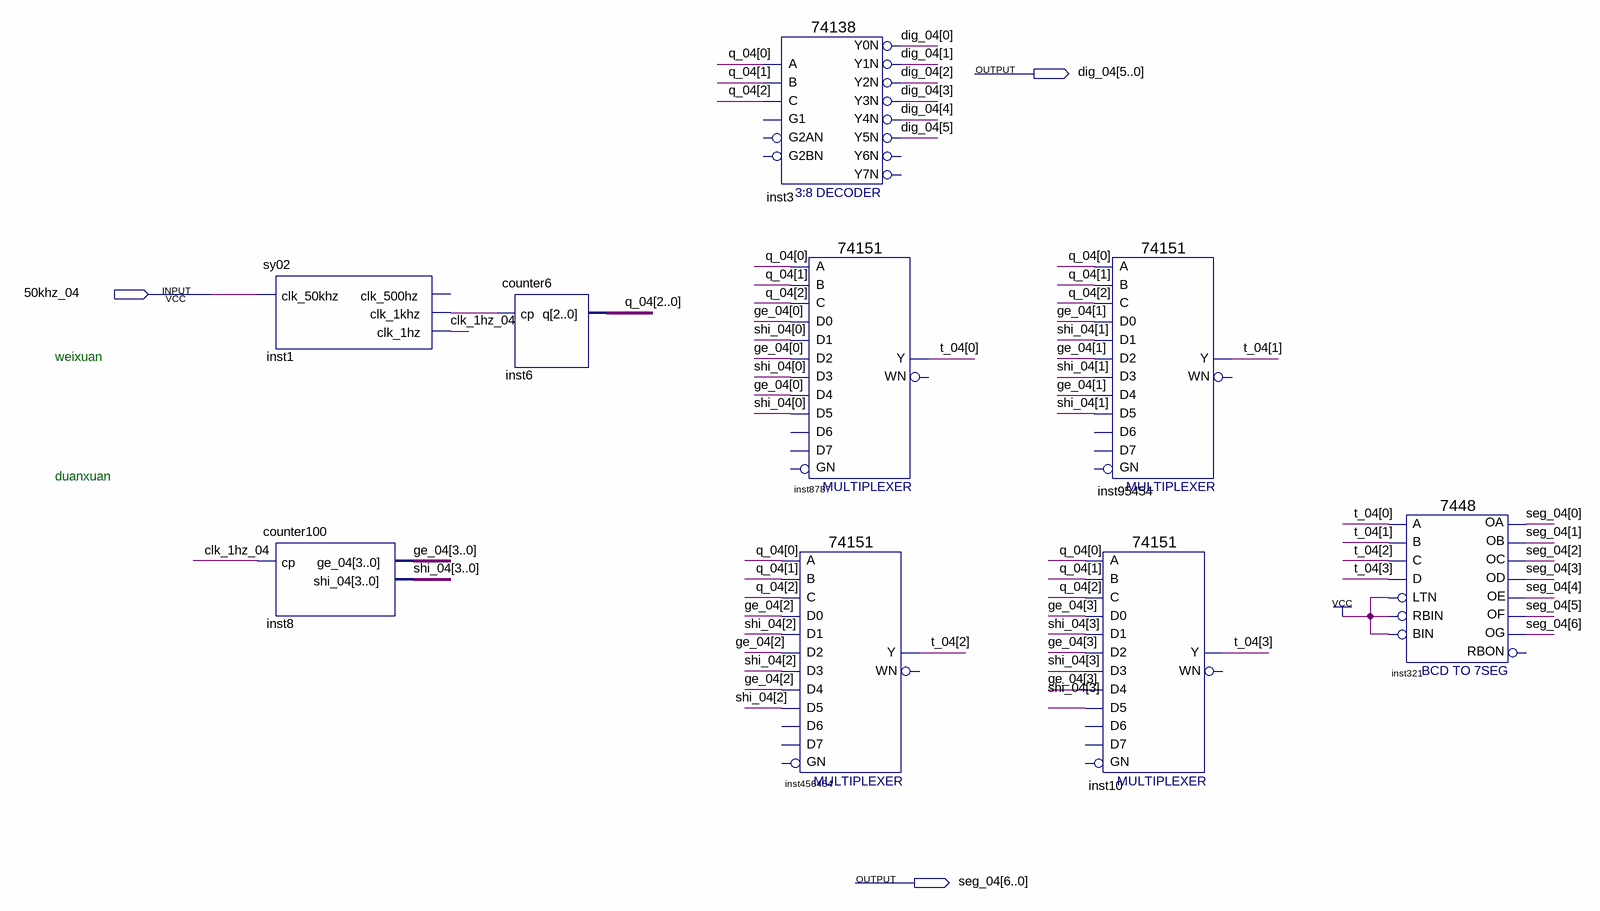
[diagram p0: schematic sheet]
// Quartus schematic sy03_m100_04_2.bdf as structural Verilog: 9 symbols, 3 pins
module sy03_m100_04_2 (
  input  \50khz_04 ,
  output [5:0] dig_04,
  output [6:0] seg_04
);

  wire clk_1hz_04, inst1_clk_1khz;
  wire [2:0] q_04;
  wire [3:0] ge_04, shi_04, t_04;

  sy02 inst1 (.clk_50khz(\50khz_04 ), .clk_1khz(inst1_clk_1khz), .clk_1hz(clk_1hz_04));  // open: clk_500hz
  counter100 inst8 (.cp(clk_1hz_04), .ge_04(ge_04), .shi_04(shi_04));
  counter6 inst6 (.cp(inst1_clk_1khz), .q(q_04));
  \74138  inst3 (
    .A(q_04[0]), .B(q_04[1]), .C(q_04[2]), .Y0N(dig_04[0]), .Y1N(dig_04[1]), .Y2N(dig_04[2]),
    .Y3N(dig_04[3]), .Y4N(dig_04[4]), .Y5N(dig_04[5]));  // open: G1, G2AN, G2BN, Y6N, Y7N
  \74151  inst8787 (
    .C(q_04[2]), .B(q_04[1]), .A(q_04[0]), .D5(shi_04[0]), .D0(ge_04[0]), .D1(shi_04[0]), .D4(ge_04[0]),
    .D3(shi_04[0]), .D2(ge_04[0]), .Y(t_04[0]));  // open: GN, D6, D7, WN
  \74151  inst456454 (
    .C(q_04[2]), .B(q_04[1]), .A(q_04[0]), .D5(shi_04[2]), .D0(ge_04[2]), .D1(shi_04[2]), .D4(ge_04[2]),
    .D3(shi_04[2]), .D2(ge_04[2]), .Y(t_04[2]));  // open: GN, D6, D7, WN
  \74151  inst95454 (
    .C(q_04[2]), .B(q_04[1]), .A(q_04[0]), .D5(shi_04[1]), .D0(ge_04[1]), .D1(shi_04[1]), .D4(ge_04[1]),
    .D3(shi_04[1]), .D2(ge_04[1]), .Y(t_04[1]));  // open: GN, D6, D7, WN
  \74151  inst10 (
    .C(q_04[2]), .B(q_04[1]), .A(q_04[0]), .D5(shi_04[3]), .D0(ge_04[3]), .D1(shi_04[3]), .D4(ge_04[3]),
    .D3(shi_04[3]), .D2(ge_04[3]), .Y(t_04[3]));  // open: GN, D6, D7, WN
  \7448  inst321 (
    .A(t_04[0]), .C(t_04[2]), .D(t_04[3]), .B(t_04[1]), .RBIN(1'b1), .BIN(1'b1), .LTN(1'b1), .OC(seg_04[2]),
    .OE(seg_04[4]), .OD(seg_04[3]), .OF(seg_04[5]), .OG(seg_04[6]), .OB(seg_04[1]), .OA(seg_04[0]));  // open: RBON

  // Notes on the sheet:
  //   weixuan
  //   duanxuan
endmodule
